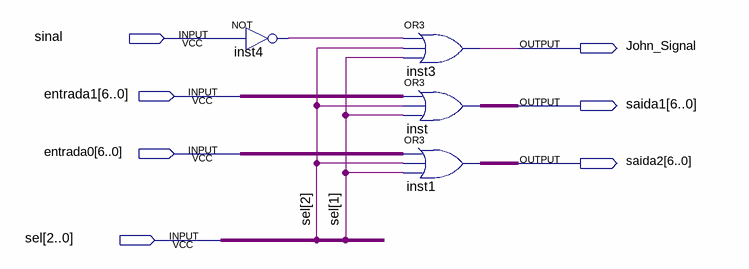
[diagram p0: schematic sheet]
// Quartus schematic display_enable.bdf as structural Verilog: 4 symbols, 7 pins
module display_enable (
  input  sinal,
  input  [6:0] entrada1,
  input  [6:0] entrada0,
  input  [2:0] sel,
  output John_Signal,
  output [6:0] saida1,
  output [6:0] saida2
);

  wire inst4_out;

  not inst4 (inst4_out, sinal);
  or inst3 (John_Signal, inst4_out, sel[2], sel[1]);
  assign saida1 = entrada1 | {7{sel[2]}} | {7{sel[1]}};  // OR3 inst, 7 bits wide
  assign saida2 = entrada0 | {7{sel[2]}} | {7{sel[1]}};  // OR3 inst1, 7 bits wide
endmodule
